# EAGLE design MDB2USB (EAGLE 9.6.2)
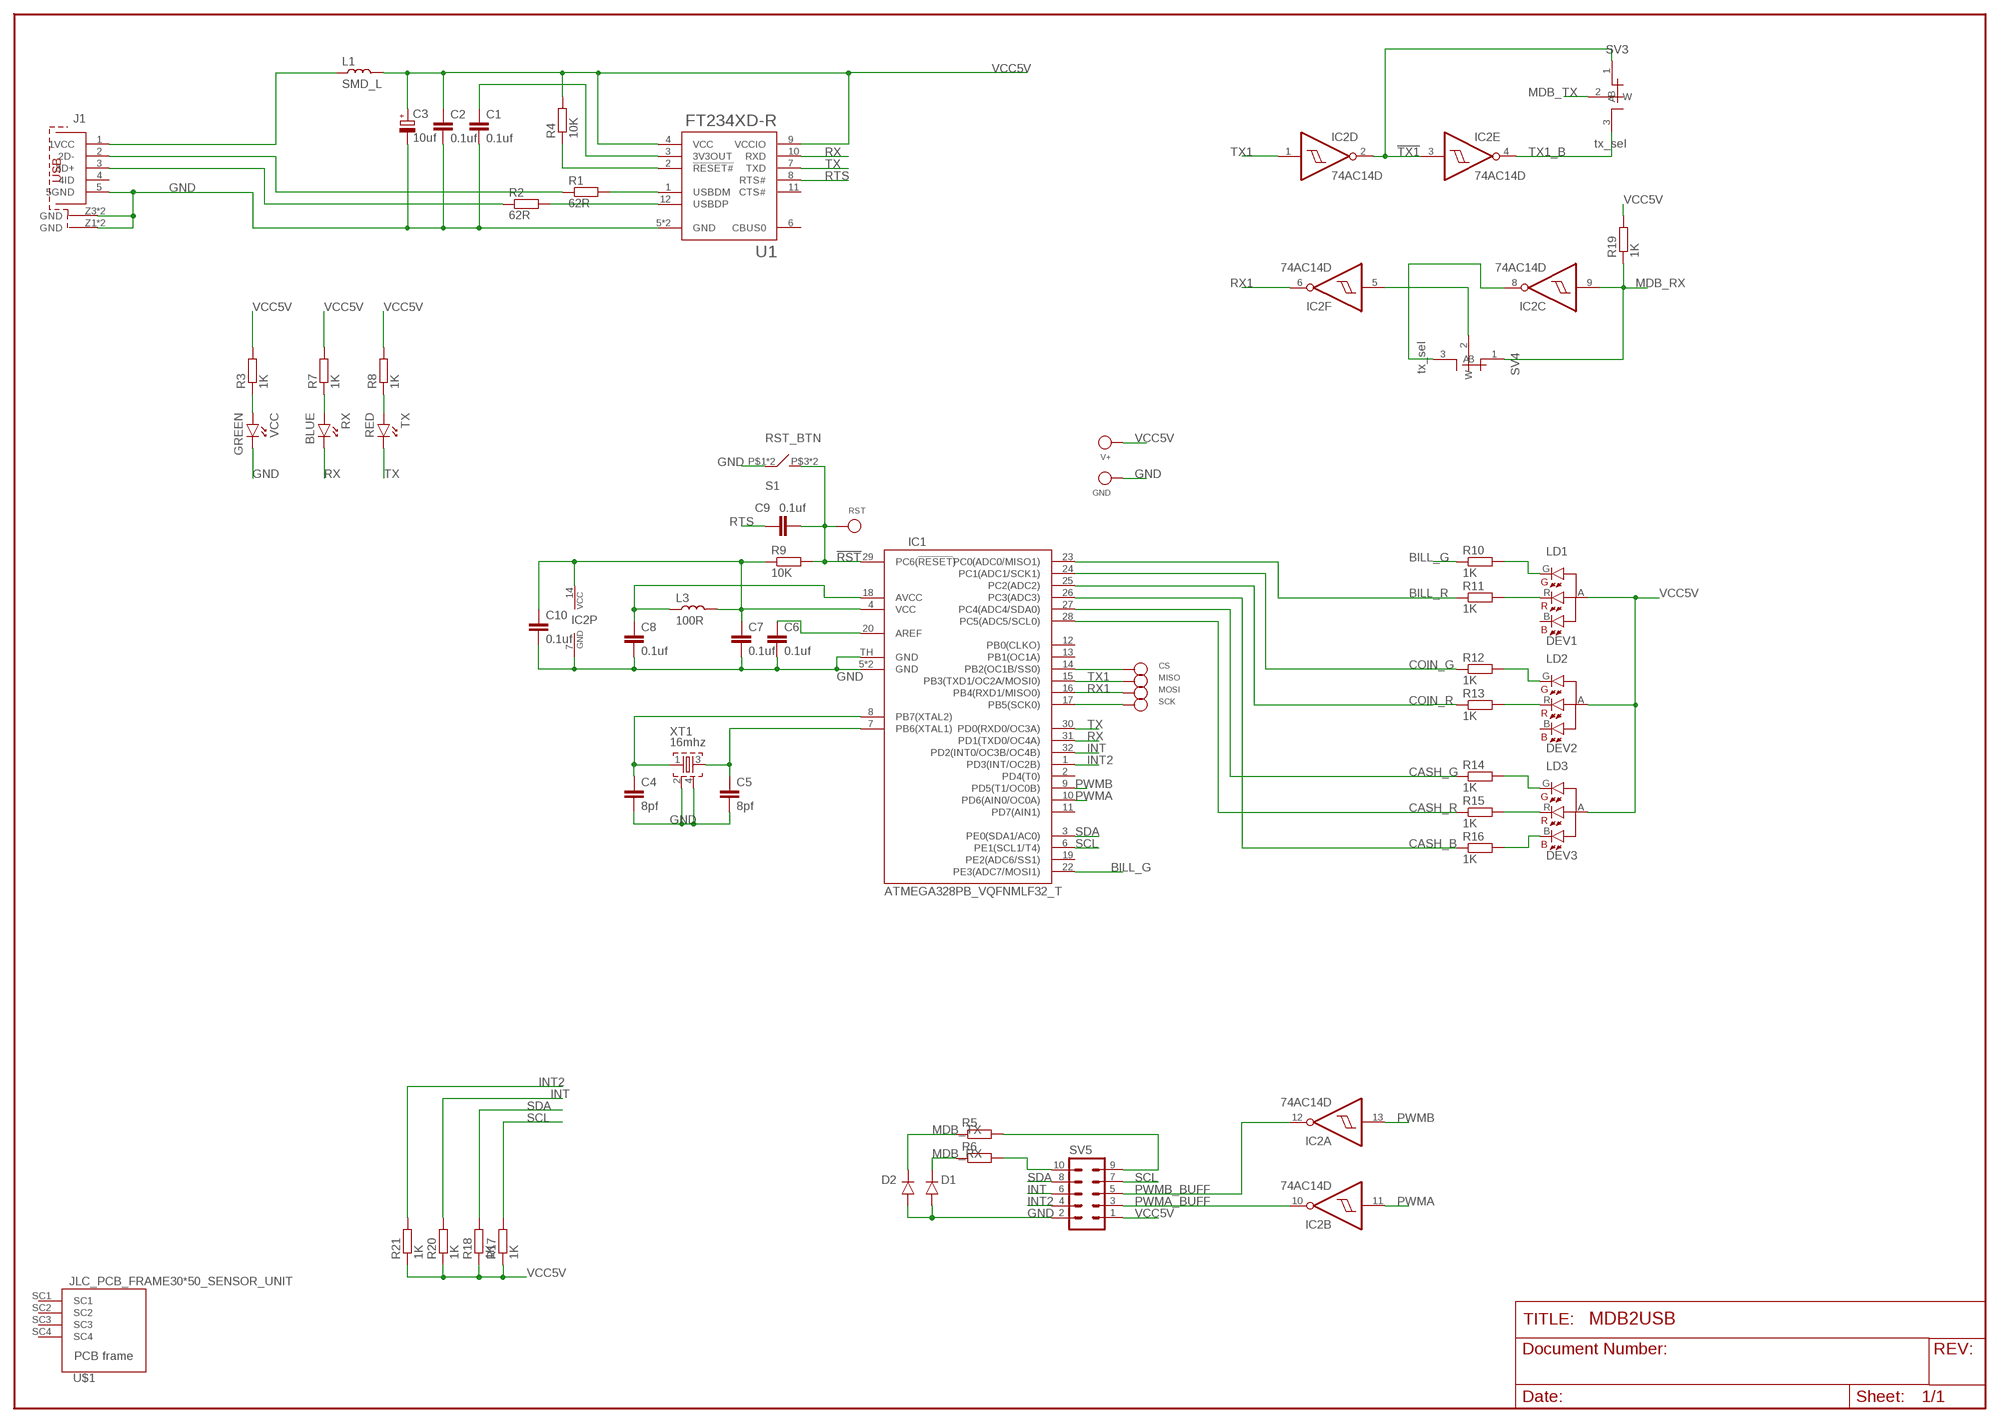
[diagram p0: schematic, sheet 1]

## Parts
C1  0.1uf  SMD_C0603  [0603]
C2  0.1uf  SMD_C0603  [0603]
C3  10uf  TANTAL_150UF_3528  [KA-3528ASYC]
C4  8pf  SMD_C0603  [0603]
C5  8pf  SMD_C0603  [0603]
C6  0.1uf  SMD_C0603  [0603]
C7  0.1uf  SMD_C0603  [0603]
C8  0.1uf  SMD_C0603  [0603]
C9  0.1uf  SMD_C0603  [0603]
C10  0.1uf  SMD_C0603  [0603]
CS  TEST_POINT_D2MM  [TP]
D1  D_MBRA340G  [SMA403D]
D2  D_MBRA340G  [SMA403D]
GND  TEST_POINT_D2MM  [TP]
IC1  ATMEGA328PB_VQFNMLF32_T  [MLF32-TH]
IC2  74AC14D  [SO14]
J1  MINI_USB_TYP_B_@  [65100516121]
L1  SMD_L  [0805]
L3  100R  SMD_L0603  [0603]
LD1  DEV1  LTSN-N213EGBW(RGB_LED)  [LTSN-N213EGBW]
LD2  DEV2  LTSN-N213EGBW(RGB_LED)  [LTSN-N213EGBW]
LD3  DEV3  LTSN-N213EGBW(RGB_LED)  [LTSN-N213EGBW]
MISO  TEST_POINT_D2MM  [TP]
MOSI  TEST_POINT_D2MM  [TP]
R1  62R  SMD_R0603  [0603]
R2  62R  SMD_R0603  [0603]
R3  1K  SMD_R0603  [0603]
R4  10K  SMD_R0603  [0603]
R5  SMD_R1206  [1206]
R6  SMD_R1206  [1206]
R7  1K  SMD_R0603  [0603]
R8  1K  SMD_R0603  [0603]
R9  10K  SMD_R0603  [0603]
R10  1K  SMD_R0603  [0603]
R11  1K  SMD_R0603  [0603]
R12  1K  SMD_R0603  [0603]
R13  1K  SMD_R0603  [0603]
R14  1K  SMD_R0603  [0603]
R15  1K  SMD_R0603  [0603]
R16  1K  SMD_R0603  [0603]
R17  1K  SMD_R0603  [0603]
R18  1K  SMD_R0603  [0603]
R19  1K  SMD_R0603  [0603]
R20  1K  SMD_R0603  [0603]
R21  1K  SMD_R0603  [0603]
RST  TEST_POINT_D2MM  [TP]
RX  BLUE  LED0603  [0603_P]
S1  RST_BTN  GALILEO_BTN  [GALILEO_VERT_BTN]
SCK  TEST_POINT_D2MM  [TP]
SV3  tx_sel  SMD_SWITCH_JUMPER  [0603_JUMP]
SV4  tx_sel  SMD_SWITCH_JUMPER  [0603_JUMP]
SV5  MA05-2  [MA05-2]
TX  RED  LED0603  [0603_P]
U1  FT234XD-R  [IC_FT234XD-R]
U$1  JLC_PCB_FRAME30*50_SENSOR_UNIT  [30X50_SENSOR_UNIT]
V+  TEST_POINT_D2MM  [TP]
VCC  GREEN  LED0603  [0603_P]
XT1  16mhz  QUARTZ_ZQ  [QUARTZ_3X3MM]

## Nets
!RST: C9.2 IC1.29(PC6(!RESET!)) R9.2 RST.P$1 S1.P$3 S1.P$4
!TX1: IC2.2(D:O) IC2.3(E:I) SV3.1(A)
AREF: C6.1 IC1.20(AREF)
AVCC: C8.1 IC1.18(AVCC) L3.1
BILL_G: IC1.22(PE3(ADC7/MOSI1)) R10.1
BILL_R: IC1.23(PC0(ADC0/MISO1)) R11.1
CASH_B: IC1.26(PC3(ADC3)) R16.1
CASH_G: IC1.27(PC4(ADC4/SDA0)) R14.1
CASH_R: IC1.28(PC5(ADC5/SCL0)) R15.1
COIN_G: IC1.24(PC1(ADC1/SCK1)) R12.1
COIN_R: IC1.25(PC2(ADC2)) R13.1
GND: C1.2 C2.2 C3.M(-) C4.2 C5.2 C6.2 C7.2 C8.2 C10.2 D1.P$2(A) D2.P$2(A) GND.P$1 IC1.5(GND) IC1.21(GND) IC1.TH(GND) IC2.7(P:GND) J1.5(5GND) J1.Z1(GND) J1.Z2(GND) J1.Z3(GND) J1.Z4(GND) S1.P$1 S1.P$2 SV5.2 U1.5(GND) U1.13(GND) VCC.1(K) XT1.2 XT1.4
INT: IC1.32(PD2(INT0/OC3B/OC4B)) R20.2 SV5.6
INT2: IC1.1(PD3(INT/OC2B)) R21.2 SV5.4
MDB_RX: D2.P$1(C) IC2.9(C:I) R6.1 R19.1 SV4.1(A)
MDB_TX: D1.P$1(C) R5.1 SV3.2(W)
N$1: J1.1(1VCC) L1.1
N$2: J1.2(2D-) R1.1
N$3: J1.3(3D+) R2.1
N$4: R4.1 U1.2(!RESET#)
N$5: R2.2 U1.12(USBDP)
N$6: R1.2 U1.1(USBDM)
N$7: C1.1 U1.3(3V3OUT)
N$8: R3.1 VCC.2(A)
N$9: C4.1 IC1.8(PB7(XTAL2)) XT1.1
N$10: C5.1 IC1.7(PB6(XTAL1)) XT1.3
N$11: IC2.5(F:I) SV4.2(W)
N$12: R7.1 RX.2(A)
N$13: R8.1 TX.2(A)
N$14: IC2.8(C:O) SV4.3(B)
N$17: LD1.G(GC) R10.2
N$18: LD1.R(RC) R11.2
N$19: LD2.G(GC) R12.2
N$20: LD2.R(RC) R13.2
N$21: LD3.G(GC) R14.2
N$22: LD3.R(RC) R15.2
N$23: LD3.B(BC) R16.2
N$24: CS.P$1 IC1.14(PB2(OC1B/SS0))
N$29: R6.2 SV5.10
N$30: R5.2 SV5.9
PWMA: IC1.10(PD6(AIN0/OC0A)) IC2.11(B:I)
PWMA_BUFF: IC2.10(B:O) SV5.3
PWMB: IC1.9(PD5(T1/OC0B)) IC2.13(A:I)
PWMB_BUFF: IC2.12(A:O) SV5.5
RTS: C9.1 U1.8(RTS#)
RX: IC1.31(PD1(TXD0/OC4A)) RX.1(K) U1.10(RXD)
RX1: IC1.16(PB4(RXD1/MISO0)) IC2.6(F:O) MOSI.P$1
SCK: IC1.17(PB5(SCK0)) SCK.P$1
SCL: IC1.6(PE1(SCL1/T4)) R17.2 SV5.7
SDA: IC1.3(PE0(SDA1/AC0)) R18.2 SV5.8
TX: IC1.30(PD0(RXD0/OC3A)) TX.1(K) U1.7(TXD)
TX1: IC1.15(PB3(TXD1/OC2A/MOSI0)) IC2.1(D:I) MISO.P$1
TX1_B: IC2.4(E:O) SV3.3(B)
VCC5V: C2.1 C3.P(+) C7.1 C10.1 IC1.4(VCC) IC2.14(P:VCC) L1.2 L3.2 LD1.A LD2.A LD3.A R3.2 R4.2 R7.2 R8.2 R9.1 R17.1 R18.1 R19.2 R20.1 R21.1 SV5.1 U1.4(VCC) U1.9(VCCIO) V+.P$1
Unconnected: IC1.2(PD4(T0)) IC1.11(PD7(AIN1)) IC1.12(PB0(CLKO)) IC1.13(PB1(OC1A)) IC1.19(PE2(ADC6/SS1)) J1.4(4ID) LD1.B(BC) LD2.B(BC) U1.6(CBUS0) U1.11(CTS#) U$1.SC1 U$1.SC2 U$1.SC3 U$1.SC4

## Library data of the parts
C1 C2 C4-C10 = passive_components:SMD_C
C3 = passive_components:TANTAL_150UF_3528
CS GND MISO MOSI RST SCK V+ = passive_components:TEST_POINT_D2MM
D1 D2 = passive_components:D_MBRA340G
IC1 = my_IC:ATMEGA328PB_VQFN
IC2 = my_IC:74*14: Hex schmitt trigger INVERTER
J1 = passive_components:MINI_USB_TYP_B_@
L1 L3 = passive_components:SMD_L
LD1-LD3 = passive_components:LTSN-N213EGBW(RGB_LED)
R1-R21 = passive_components:SMD_R
RX TX VCC = passive_components:LED
S1 = passive_components:GALILEO_BTN
SV3 SV4 = passive_components:SMD_SWITCH_JUMPER
SV5 = con-lstb:MA05-2: PIN HEADER; OC_FARNELL: unknown; OC_NEWARK: unknown
U1 = my_IC:FT234XD-R: USB Bridge, USB to UART USB 2.0 UART Interface 12-DFN (3x3); AVAILABILITY: Unavailable; DESCRIPTION: USB Bridge, USB to UART USB 2.0 UART Interface 12-DFN (3x3); MF: FTDI,; MP: FT234XD-R; PACKAGE: DFN-12 FTDI; PRICE: None
U$1 = passive_components:JLC_PCB_FRAME
XT1 = passive_components:QUARTZ_ZQ

## Board
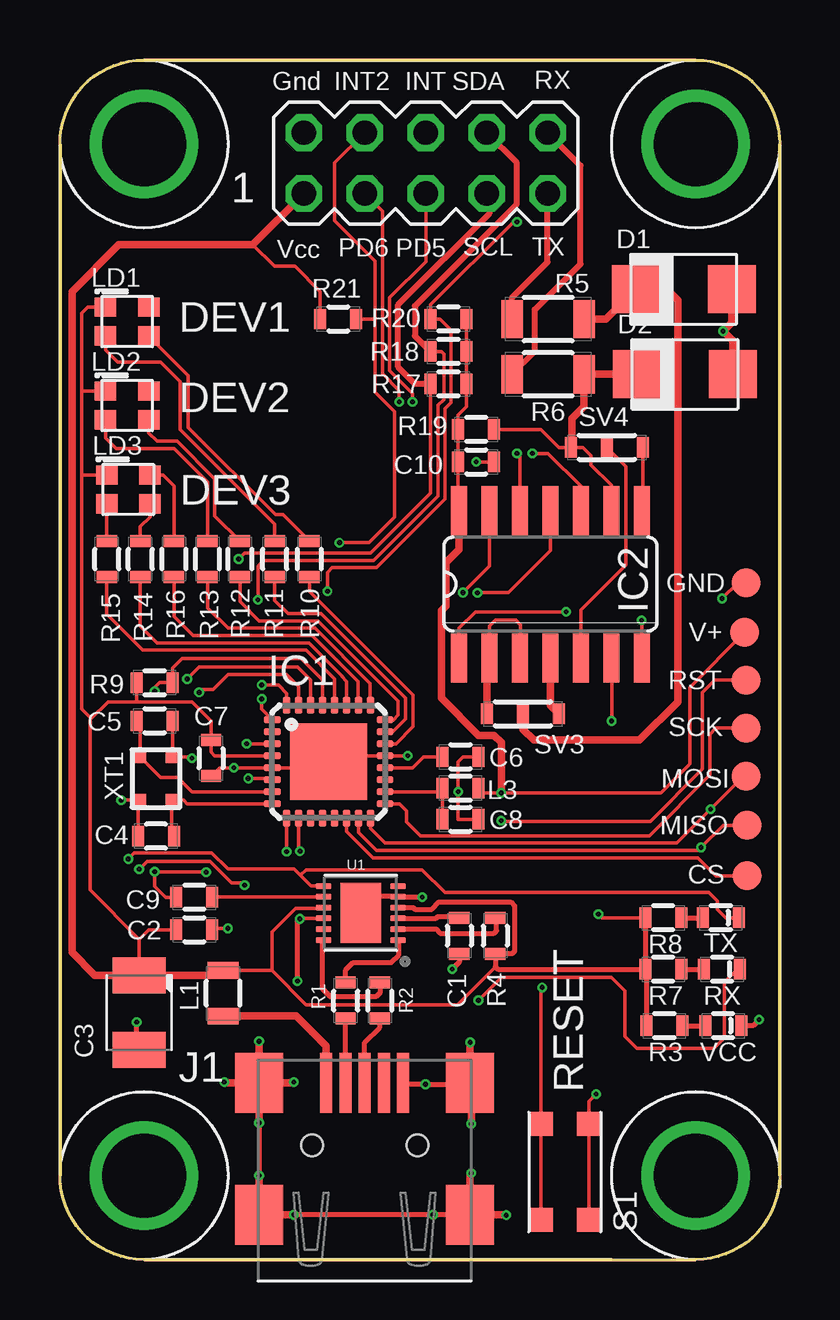
[diagram p1: board, top side]
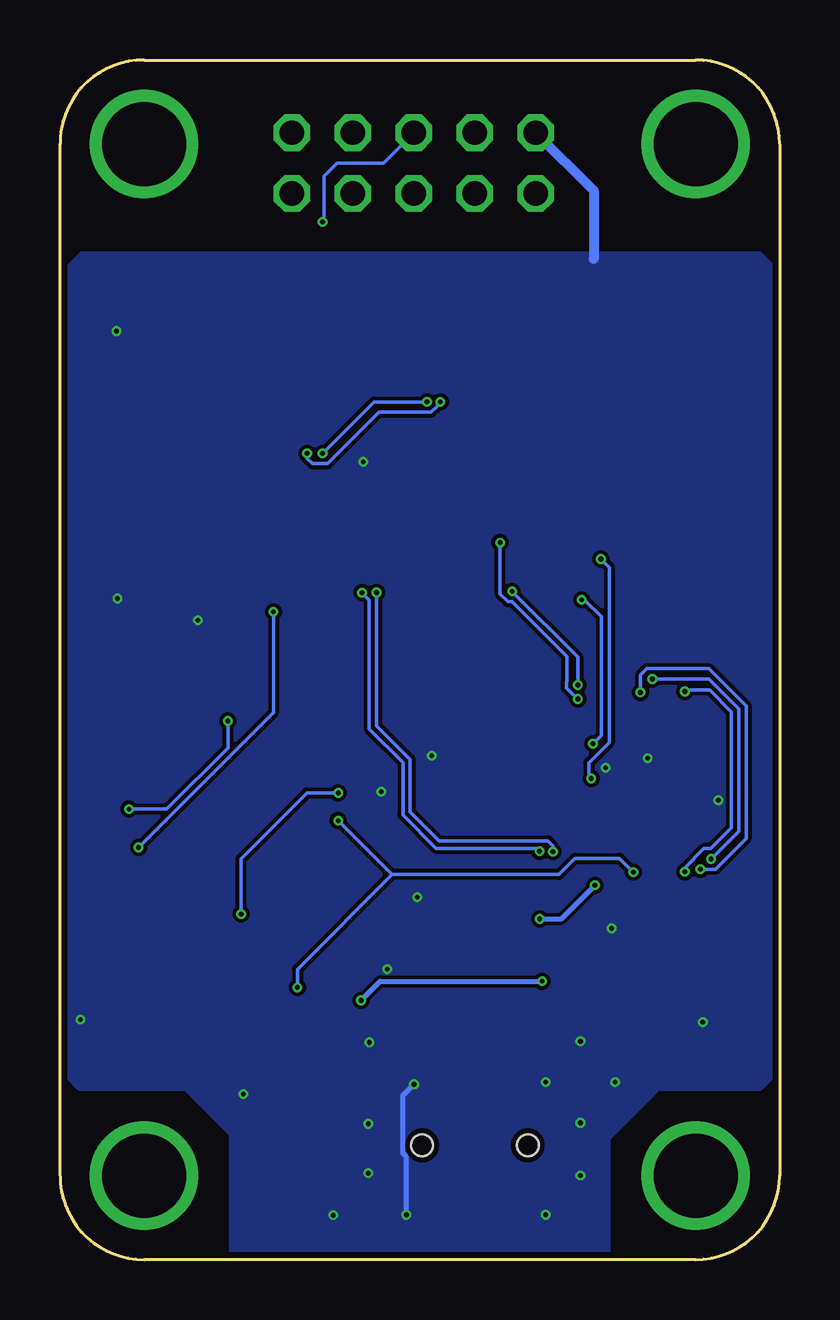
[diagram p2: board, bottom side, seen from below]

Size 30 x 50 mm. Coordinates in mm from the lower left corner, seen from the top.
Copper layers (1*16): Top 0.035mm / dielectric 1.5mm / Bottom 0.035mm
Design rules "default *": minimum track width 2mil, minimum drill 0.2mm, track to track 6mil, track to pad 6mil, pad to pad 6mil, via to via 6mil, smd to smd 6mil, copper to edge 10mil, drill to drill 6mil, minimum pad ring 4mil, minimum via ring 4mil, stop-mask expansion 2mil, vias tented up to drill 10mm, thermal gap 10mil

### Footprints (pad centres in the part's own frame; a part is rotated, then mirrored left to right if it is on the bottom)
0603 = smd 0.85 x 0.5: 1 0,0.75; 2 0,-0.75
KA-3528ASYC = smd 1.5 x 2.2: M -1.55,0; P 1.55,0
TP = smd 1.2 x 1.2: P$1 0,0
SMA403D = smd 2 x 2: P$1 -2,0; P$2 2,0
MLF32-TH = smd 0.7 x 0.3: 1 -2.35,1.75; 2 -2.35,1.25; 3 -2.35,0.75; 4 -2.35,0.25; 5 -2.35,-0.25; 6 -2.35,-0.75; 7 -2.35,-1.25; 8 -2.35,-1.75; 17 2.35,-1.75; 18 2.35,-1.25; 19 2.35,-0.75; 20 2.35,-0.25; 21 2.35,0.25; 22 2.35,0.75; 23 2.35,1.25; 24 2.35,1.75 | smd 0.3 x 0.7: 9 -1.75,-2.35; 10 -1.25,-2.35; 11 -0.75,-2.35; 12 -0.25,-2.35; 13 0.25,-2.35; 14 0.75,-2.35; 15 1.25,-2.35; 16 1.75,-2.35; 25 1.75,2.35; 26 1.25,2.35; 27 0.75,2.35; 28 0.25,2.35; 29 -0.25,2.35; 30 -0.75,2.35; 31 -1.25,2.35; 32 -1.75,2.35 | smd 3.2 x 3.2: TH 0,0
SO14 = smd 0.66 x 2.032: 1 -3.81,-3.073; 2 -2.54,-3.073; 3 -1.27,-3.073; 4 0,-3.073; 5 1.27,-3.073; 6 2.54,-3.073; 7 3.81,-3.073; 8 3.81,3.073; 9 2.54,3.073; 10 1.27,3.073; 11 0,3.073; 12 -1.27,3.073; 13 -2.54,3.073; 14 -3.81,3.073
65100516121 = smd 0.5 x 2.5: 1 -1.6,2.6; 2 -0.8,2.6; 3 0,2.6; 4 0.8,2.6; 5 1.6,2.6 | smd 2 x 2.5: Z1 -4.4,2.6; Z2 4.4,2.6; Z3 4.4,-2.9; Z4 -4.4,-2.9 | hole 0.9: -2.2,0; 2.2,0
0805 = smd 1.3 x 0.7: 1 0,0.95; 2 0,-0.95
LTSN-N213EGBW = smd 0.9 x 0.8: A 0.9,-0.6; B -0.9,-0.6; G -0.9,0.6; R 0.9,0.6
1206 = smd 1.6 x 0.9: 1 0,1.5; 2 0,-1.5
0603_P = smd 0.85 x 0.5: 1 0,0.75; 2 0,-0.75
GALILEO_VERT_BTN = smd 1 x 1: P$1 -2,1; P$2 2,1; P$3 -2,-1; P$4 2,-1
0603_JUMP = smd 0.85 x 0.5: 1 0,0.75; 2 0,-0.75; 3 0,-2.25
MA05-2 = drill 1.016 octagon: 1 -5.08,-1.27; 2 -5.08,1.27; 3 -2.54,-1.27; 4 -2.54,1.27; 5 0,-1.27; 6 0,1.27; 7 2.54,-1.27; 8 2.54,1.27; 9 5.08,-1.27; 10 5.08,1.27
IC_FT234XD-R = smd 0.65 x 0.25: 1 -1.55,1.125; 2 -1.55,0.675; 3 -1.55,0.225; 4 -1.55,-0.225; 5 -1.55,-0.675; 6 -1.55,-1.125; 7 1.55,-1.125; 8 1.55,-0.675; 9 1.55,-0.225; 10 1.55,0.225; 11 1.55,0.675; 12 1.55,1.125 | smd 1.7 x 2.5: 13 0,0
30X50_SENSOR_UNIT = drill 3.5: SC1 3.5,46.5; SC2 26.5,46.5; SC3 3.5,3.5; SC4 26.5,3.5
QUARTZ_3X3MM = smd 0.5 x 0.5: 1 -0.65,0.9; 2 0.65,0.9; 3 0.65,-0.9; 4 -0.65,-0.9

### Placement (x,y rotation side)
C1  16.65,13.5 0 top
C2  5.6,13.75 90 top
C3  3.3,10.3 90 top
C4  4,17.65 270 top
C5  3.95,22.45 90 top
C6  16.7,20.95 90 top
C7  6.3,20.9 0 top
C8  16.7,18.35 90 top
C9  5.6,15.1 270 top
C10  17.35,33.25 90 top
CS  28.65,16 0 top
D1  26,40.45 0 top
D2  26.05,36.9 0 top
GND  28.6,28.2 0 top
IC1  11.2,20.75 0 top
IC2  20.45,28.15 0 top
J1  12.7,4.76 0 top
L1  6.8,11.1 180 top
L3  16.7,19.65 90 top
LD1  2.8,39.1 180 top
LD2  2.8,35.6 180 top
LD3  2.85,32.1 180 top
MISO  28.65,18.1 0 top
MOSI  28.6,20.15 0 top
R1  11.91,10.79 180 top
R2  13.34,10.79 180 top
R3  25.2,9.75 270 top
R4  18.15,13.5 0 top
R5  20.35,39.2 270 top
R6  20.35,36.9 270 top
R7  25.15,12.1 270 top
R8  25.15,14.25 270 top
R9  3.95,24.05 90 top
R10  10.4,29.2 180 top
R11  8.95,29.2 180 top
R12  7.5,29.2 180 top
R13  6.15,29.2 180 top
R14  3.35,29.2 180 top
R15  1.95,29.2 180 top
R16  4.75,29.2 180 top
R17  16.2,36.5 270 top
R18  16.2,37.85 270 top
R19  17.35,34.6 270 top
R20  16.2,39.2 270 top
R21  11.6,39.2 90 top
RST  28.6,24.15 0 top
RX  27.6,12.1 270 top
S1  21.05,3.65 270 top
SCK  28.6,22.15 0 top
SV3  18.55,22.75 90 top
SV4  22.05,33.85 90 top
SV5  15.25,45.7 0 top
TX  27.55,14.25 270 top
U1  12.54,14.45 180 top
U$1  0,0 0 top
V+  28.55,26.15 0 top
VCC  27.65,9.75 270 top
XT1  4,20.05 180 top

### Tracks (layer width: path | path; a pad name or v marks a point on that pad's centre or on a via)
!RST  (via drill 0.2, 0.2 pad 0.01)
  Top 0.152: IC1.29 10.95,24.15 10.05,25.05 5.1,25.05 4.7,24.65 R9.2 4.15,24.05 3.95,23.85 v3.95,23.68 | C9.2 4.4,15.1 3.95,15.55 v3.95,16.16 6.08,16.16 v6.1,16.15 | v18.4,18.3 18.43,18.27 24.62,18.27 26.79,20.44 26.79,23.64 27.3,24.15 RST.P$1 | S1.P$4 S1.P$3 20.05,11.29 v20.1,11.34
  Bottom 0.152: v3.95,23.68 3.9,23.73 2.92,23.73 2,22.82 2,18 2.87,17.13 3.15,17.13 3.95,16.33 v3.95,16.16 | v6.1,16.15 6.67,16.72 8.53,16.72 9.21,16.05 16.15,16.05 | v18.4,18.3 16.15,16.05 | 16.15,16.05 20.1,12.1 v20.1,11.34
!TX1
  Top 0.152: IC2.2 17.91,26.41 18.15,26.65 19,26.65 19.2,26.45 19.2,25.1 IC2.3
  Top 0.305: SV3.1 17.8,24.97 IC2.2
AREF
  Top 0.152: IC1.20 14.7,20.5 15.15,20.95 C6.1
AVCC
  Top 0.152: IC1.18 15.8,19.5 L3.1 C8.1
BILL_G
  Top 0.152: IC1.22 14,21.5 14.71,22.21 14.71,23.53 10.4,27.84 R10.1
BILL_R
  Top 0.152: IC1.23 13.57,22.02 13.9,22.02 14.4,22.52 14.4,23.4 10.88,26.92 9.5,26.92 8.95,27.47 R11.1
CASH_B
  Top 0.152: R16.1 4.75,26.81 5.55,26.01 10.5,26.01 12.43,24.08 12.43,23.12 IC1.26
CASH_G
  Top 0.152: R14.1 3.35,26.41 4.05,25.7 10.38,25.7 11.76,24.33 11.76,24.3 11.95,24.1 IC1.27
CASH_R
  Top 0.152: R15.1 1.95,26.9 3.45,25.4 10.25,25.4 11.45,24.2 IC1.28
COIN_G
  Top 0.152: IC1.24 13.9,22.5 14.1,22.7 14.1,23.27 10.76,26.62 8.3,26.62 7.5,27.42 R12.1
COIN_R
  Top 0.152: R13.1 6.15,27.16 7,26.31 10.63,26.31 12.93,24.02 12.93,23.12 IC1.25
GND  (via drill 0.2, 0.2 pad 0.01)
  Top 0.152: C4.2 3.25,19.05 XT1.2 v2.55,19.15 | C5.2 4.7,21 XT1.4 5.45,20.95 v5.5,20.9 | v14.5,21 IC1.21 11.45,21 IC1.TH 10.95,20.5 IC1.5 v7.25,20.5 6.65,20.5 C7.2 | C8.2 16.6,18.35 v16.6,19.5 16.6,20.75 16.8,20.95 C6.2 | C2.2 6.4,13.8 v7,13.8 | IC2.7 v24.26,26.64 v24.25,26.65 | C10.2 v17.35,33.25 | GND.P$1 28.25,28.2 v27.6,27.55 | S1.P$2 S1.P$1 22.05,6.6 v22.35,6.9
  Top 0.203: v8.3,5.7 v8.3,3.5 8.3,1.91 | 8.3,1.91 J1.Z4 | 8.3,1.91 8.34,1.86 v9.75,1.86 v15.56,1.86 J1.Z3 | J1.5 14.36,7.3 v15.24,7.3 17.04,7.3 J1.Z2 17.62,7.89 | U1.13 13.23,15.13 U1.5 15.08,15.12 v15.1,15.1 | C3.M 3.2,8.85 v3.2,9.9 | C1.2 16.65,12.4 v16.35,12.1 | VCC.1 28.9,9.75 v29.15,10
  Top 0.305: J1.Z1 6.89,7.36 v6.85,7.4 | J1.Z1 v8.3,9.1 | J1.Z1 9.71,7.36 v9.75,7.4 | J1.Z1 v8.3,5.7 | v8.3,3.5 J1.Z4 v9.75,1.86 | v18.6,1.85 18.59,1.86 J1.Z3 17.1,3.55 v17.15,3.6 | v17.1,9.05 J1.Z2 17.15,7.31 v17.15,5.65 | D2.P$2 28.05,38.3 v27.65,38.7 28,39.05 D1.P$2
  Bottom 0.203: v15.56,1.86 15.56,4.28 15.71,4.43 15.71,6.84 v15.24,7.3
  Bottom 0.406: SV5.2 7.75,44.55 7.75,41.7
  pour Bottom: 7.14,0.32 7.14,5.08 5.08,7.14 0.79,7.14 0.32,7.62 0.32,41.41 0.82,41.91 29.1,41.91 29.69,41.32 29.69,7.62 29.21,7.14 24.77,7.14 22.86,5.24 22.86,0.32
INT  (via drill 0.2)
  Top 0.152: v19.05,43.25 18.9,43.25 15.45,39.8 R20.2 15.85,39.2 16.3,38.74 16.3,35.72 16.06,35.48 16.06,31.7 13.2,28.84 11.35,28.84 11.15,28.64 v11.15,27.85 | v8.41,23.95 v8.42,23.94 9.11,23.94 9.45,23.6 IC1.32
  Bottom 0.152: v19.05,43.25 19,43.3 19,45.15 18.45,45.7 16.52,45.7 SV5.6 | v11.15,27.85 8.41,25.11 v8.41,23.95
INT2  (via drill 0.2)
  Top 0.152: IC1.1 8.41,22.94 v8.41,23.36 | v11.65,29.88 12.88,29.88 13.95,30.95 13.95,35.34 13.13,36.15 13.13,39.2 | SV5.4 11.45,45.71 11.45,43.3 13.13,41.62 13.13,39.2 | R21.2 13.13,39.2
  Bottom 0.152: v8.41,23.36 8.43,23.36 8.89,23.82 8.89,24.08 8.87,24.1 8.87,25.13 11.15,27.42 11.33,27.42 11.65,27.74 v11.65,29.88
MDB_RX
  Top 0.152: IC2.9 22.99,32.27 22.14,33.12 22.14,33.51 21.8,33.85 SV4.1 20.8,33.85 20.05,34.6 R19.1
  Top 0.305: D2.P$1 R6.1 21.85,35.55 21.35,35.05 21.35,33.9 SV4.1
MDB_TX
  Top 0.305: SV3.2 19.3,22.1 19.75,21.65 24.15,21.65 25.75,23.25 25.75,40 25.3,40.45 D1.P$1 22.75,39.2 R5.1
N$1
  Top 0.305: J1.1 11.1,8.9 9.85,10.15 L1.1
N$2
  Top 0.203: J1.2 R1.1
N$3
  Top 0.203: J1.3 12.7,9.05 13.34,9.68 R2.1
N$4
  Top 0.203: U1.2 15.68,13.77 15.85,13.6 18.1,13.6 18.2,13.7 18.2,14.2 R4.1
N$5
  Top 0.203: R2.2 13.34,11.11 13.18,10.95 11.27,10.95 10.95,11.27 10.95,13.28 U1.12
N$6
  Top 0.203: R1.2 11.91,12.06 12.22,12.38 13.81,12.38 14.13,12.7 14.13,13.28 U1.1
N$7
  Top 0.203: U1.3 15.67,14.22 15.75,14.3 16.6,14.3 C1.1
N$8
  Top 0.203: R3.1 VCC.2
N$9
  Top 0.152: IC1.8 5.3,19 5.15,19.15 XT1.1 4.65,17.75 C4.1
N$10
  Top 0.152: C5.1 3.35,22.3 XT1.3 4.2,20.1 4.9,20.1 5.5,19.5 IC1.7
N$11
  Top 0.152: SV4.2 23.6,33.05 23.6,28.95 21.72,27.07 IC2.5
N$12
  Top 0.203: R7.1 RX.2
N$13
  Top 0.203: R8.1 TX.2
N$14
  Top 0.152: SV4.3 24.3,31.26 IC2.8
N$17
  Top 0.152: LD1.G 5.35,36.85 5.35,34.68 8.98,31.05 9.3,31.05 R10.2
N$18
  Top 0.152: LD1.R 1.9,37.9 2.4,37.4 4.2,37.4 5,36.6 5,34.6 8.95,30.65 R11.2
N$19
  Top 0.152: LD2.G 3.7,34.45 4.04,34.1 4.88,34.1 6.46,32.53 6.46,31 R12.2
N$20
  Top 0.152: LD2.R 1.9,34.25 2.35,33.8 4.75,33.8 6.15,32.4 R13.2
N$21
  Top 0.152: LD3.G 3.75,30.95 3.35,30.55 R14.2
N$22
  Top 0.152: LD3.R R15.2
N$23
  Top 0.152: LD3.B 4.3,32.7 4.75,32.25 R16.2
N$24
  Top 0.152: CS.P$1 27.35,16 26.6,16.75 13.05,16.75 11.95,17.85 IC1.14
N$29
  Top 0.254: SV5.10 21.7,45.6 21.7,41.5 19.8,39.6 19.8,37.85 R6.2
N$30
  Top 0.254: R5.2 18.85,40.1 20.33,41.58 SV5.9
PWMA  (via drill 0.2)
  Top 0.152: IC2.11 20.45,29.55 18.7,27.8 v17.4,27.8 | v10.01,17.02 9.96,17.07 IC1.10
  Bottom 0.152: v17.4,27.8 17.11,27.5 17.11,22.12 15.71,20.72 15.71,18.52 14.33,17.14 10.13,17.14 v10.01,17.02
PWMA_BUFF  (via drill 0.2)
  Top 0.152: IC2.10 21.72,32.23 20.35,33.6 v19.7,33.6 | v14.14,35.75 14.14,36.22 13.44,36.93 13.44,43.7 SV5.3
  Bottom 0.152: v14.14,35.75 14.27,35.62 14.27,35.57 14.52,35.32 16.69,35.32 18.84,33.17 19.48,33.17 19.7,33.39 v19.7,33.6
PWMB  (via drill 0.2)
  Top 0.152: IC2.13 17.91,28.91 v16.8,27.8 | IC1.9 v9.45,17
  Bottom 0.152: v16.8,27.8 16.8,22.25 15.4,20.85 15.4,18.65 14.2,17.45 9.65,17.45 9.45,17.25 v9.45,17
PWMB_BUFF  (via drill 0.2)
  Top 0.152: IC2.12 19.18,33.47 v19.05,33.6 | v14.7,35.75 14.7,36.1 13.74,37.05 13.74,40.09 15.25,41.6 SV5.5
  Bottom 0.152: v19.05,33.6 16.9,35.75 v14.7,35.75
RTS
  Top 0.152: U1.8 6.37,15.12 C9.1
RX  (via drill 0.2, 0.2 pad 0.01)
  Top 0.152: IC1.31 9.95,23.89 9.45,24.39 7.01,24.39 6.38,23.77 5.92,23.77 v5.8,23.64 | v7.7,15.6 7.6,15.7 7.15,15.7 6.25,16.59 3.62,16.59 v3.3,16.27 | U1.10 10.02,14.22 | v17.45,10.81 18.41,11.77 22.98,11.77 23.55,11.2 23.55,9.3 24.05,8.8 27.25,8.8 27.7,9.25 27.7,11.55 28.3,12.15
  Top 0.203: 10.02,14.22 v10,14.2 9.9,14.1 v9.9,11.6 | 28.3,12.15 RX.1
  Bottom 0.152: v5.8,23.64 5.8,24.36 5.53,24.63 2.94,24.63 1.4,23.08 1.4,17.55 2.67,16.27 v3.3,16.27
  Bottom 0.203: v10,14.2 9.1,14.2 v7.7,15.6 | v17.45,10.81 16.66,11.6 v9.9,11.6
RX1  (via drill 0.2)
  Top 0.152: IC1.16 12.95,17.96 13.55,17.36 25.71,17.36 v27.12,18.77 28.5,20.15 MOSI.P$1 | v23,22.45 23,25.07 IC2.6
  Bottom 0.152: v27.12,18.77 25.56,18.77 23,21.33 v23,22.45
SCK
  Top 0.152: IC1.17 14.15,19 14.45,18.7 14.45,18.25 15.04,17.66 24.57,17.66 27.09,20.19 27.09,21.89 27.35,22.15 SCK.P$1
SCL  (via drill 0.2)
  Top 0.152: R17.2 15.45,31.95 12.95,29.45 7.7,29.45 v7.45,29.2 | v7.85,20.05 8.8,20.05 IC1.6
  Top 0.254: R17.2 14.8,36.5 14.1,37.2 14.1,39.8 17.9,43.6 17.9,44.32 SV5.7
  Bottom 0.152: v7.45,29.2 7.1,28.85 7.1,21.55 7.95,20.7 7.95,20.15 v7.85,20.05
SDA  (via drill 0.2)
  Top 0.152: R18.2 15.9,37.85 16,37.75 16,35.85 15.76,35.6 15.76,31.82 13.08,29.14 8.49,29.14 8.25,28.9 v8.25,27.5 | v7.78,21.5 IC1.3
  Top 0.254: R18.2 14.8,38.5 14.8,39.75 19.05,44 19.05,45.71 SV5.8
  Bottom 0.152: v8.25,27.5 8.13,27.5 7.43,26.8 7.43,21.85 v7.78,21.5
TX  (via drill 0.2 pad 0.01)
  Top 0.152: IC1.30 10.45,24.15 9.9,24.7 5.81,24.7 v5.3,24.2 | v2.85,16.7 3.1,16.95 6.33,16.95 7,16.28 9.75,16.28 10,16.03 | 10,16.03 10.03,16.03 10.25,16.25 15.1,16.25 16.05,15.3 27.05,15.3 27.4,14.95 27.4,14.6 27.75,14.25 TX.1 | U1.7 10.46,15.57 10,16.03
  Bottom 0.152: v5.3,24.2 2.95,24.2 1.7,22.95 1.7,17.85 v2.85,16.7
TX1  (via drill 0.2 pad 0.01)
  Top 0.152: IC1.15 12.45,17.8 13.2,17.05 26.61,17.05 v26.73,17.18 27.65,18.1 MISO.P$1 | v21.1,27 17.31,27 16.64,26.33 IC2.1
  Bottom 0.152: v21.1,27 21.1,22.8 v26.73,17.18
TX1_B
  Top 0.305: SV3.3 20.45,23.1 IC2.4
VCC5V  (via drill 0.2)
  Top 0.152: IC1.4 6.45,21 6.3,21.15 C7.1 6.3,22.45 5.5,23.25 3.15,23.25 | 1.3,22.55 1.25,22.5 1.25,15.4 3.3,13.35 | 1.3,22.55 2,23.25 3.15,23.25 | R8.2 22.6,14.25 v22.45,14.4 | L3.2 17.65,19.45 v18.4,19.45 25.05,19.45 26.25,20.65 26.25,23.85 V+.P$1 | R9.1 3.2,23.3 3.15,23.25 | C3.P 3.3,13.35 | C2.1 3.7,13.75 3.3,13.35 | 8.84,12.05 L1.2 | 8.84,12.05 10.27,10.62 16.57,10.62 18.15,12.2 | 8.84,12.05 8.84,13.65 9.82,14.63 10.95,14.63 U1.9 | LD1.A 1.15,39.7 0.9,39.45 0.9,36.25 | 0.9,36.25 0.9,32.7 | 0.9,32.7 0.9,22.95 1.3,22.55 | LD3.A 0.9,32.7 | LD2.A 0.95,36.2 0.9,36.25 | IC2.14 16.6,31.26 C10.1 R19.2 16.6,35.2 16.95,35.55 R17.1 R18.1 R20.1 | R21.1 10.85,40.35 9.8,41.4 8.94,41.4 8.04,42.3
  Top 0.203: C3.P 3.4,11.95 | 6.7,11.95 L1.2 | U1.4 14.73,14.67 14.8,14.6 15.5,14.6 15.8,14.9 18.8,14.9 18.95,14.75 18.95,12.85 18.85,12.75 R4.2 18.15,12.2 18.25,12.1 R7.2 | R8.2 R7.2 | R7.2 24.45,12.05 R3.2
  Top 0.305: IC2.14 16.64,29.59 16.1,29.05 16.1,27.25 15.9,27.05 15.9,23.4 17.45,21.85 18.1,21.85 18.4,21.55 v18.4,19.45 | 6.7,11.95 6.6,11.85 C3.P 1.45,11.85 0.5,12.8 0.5,40.35 2.45,42.3 8.04,42.3 SV5.1
  Bottom 0.152: v22.45,14.4 22.45,16.7 19.7,19.45 v18.4,19.45

### Text on the board
tNames: Gnd | INT2 | INT | SDA | RX | PD5 | SCL | TX | Vcc | PD6 | DEV1 | DEV2 | DEV3 | RESET